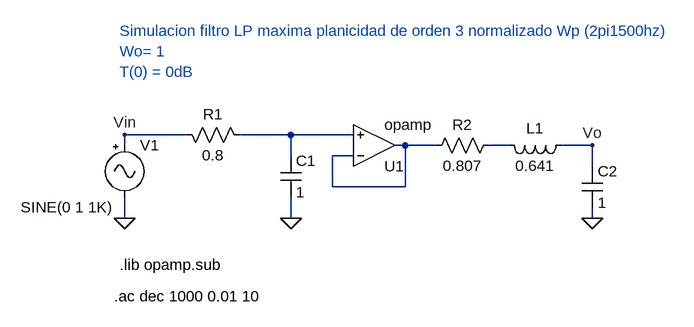
[diagram p0: schematic ts_3_normalizado.asc]
ts_3_normalizado.asc, the LTspice schematic file:
Version 4
SHEET 1 880 680
WIRE -288 32 -384 32
WIRE -128 32 -208 32
WIRE -32 32 -128 32
WIRE -384 48 -384 32
WIRE 48 48 32 48
WIRE 96 48 48 48
WIRE 208 48 176 48
WIRE 336 48 288 48
WIRE -128 64 -128 32
WIRE -32 64 -64 64
WIRE 336 80 336 48
WIRE -64 112 -64 64
WIRE 48 112 48 48
WIRE 48 112 -64 112
WIRE -384 160 -384 128
WIRE -128 160 -128 128
WIRE 336 160 336 144
FLAG -384 160 0
FLAG -384 32 Vin
FLAG 336 48 Vo
FLAG -128 160 0
FLAG 336 160 0
SYMBOL res -192 48 M270
WINDOW 0 32 56 VTop 2
WINDOW 3 0 56 VBottom 2
SYMATTR InstName R1
SYMATTR Value 0.8
SYMBOL Misc/signal -384 32 R0
WINDOW 3 -160 111 Left 2
SYMATTR InstName V1
SYMATTR Value2 AC 1
SYMBOL cap -144 64 R0
SYMATTR InstName C1
SYMATTR Value 1
SYMBOL cap 320 80 R0
SYMATTR InstName C2
SYMATTR Value 1
SYMBOL res 192 32 R90
WINDOW 0 0 56 VBottom 2
WINDOW 3 32 56 VTop 2
SYMATTR InstName R2
SYMATTR Value 0.807
SYMBOL ind 304 32 R90
WINDOW 0 5 56 VBottom 2
WINDOW 3 32 56 VTop 2
SYMATTR InstName L1
SYMATTR Value 0.641
SYMBOL Opamps/opamp 0 112 M180
SYMATTR InstName U1
TEXT -400 280 Left 2 !.ac dec 1000 0.01 10
TEXT -392 232 Left 2 !.lib opamp.sub
TEXT -392 -128 Left 2 ;Simulacion filtro LP maxima planicidad de orden 3 normalizado Wp (2pi1500hz)\nWo= 1\nT(0) = 0dB

The netlist it stands for:
* ts_3_normalizado.asc
R1 N001 Vin 0.8
V1 Vin 0 SINE(0 1 1K) AC 1
C1 N001 0 1
C2 Vo 0 1
R2 N003 N002 0.807
L1 Vo N003 0.641
XU1 N002 N001 N002 opamp Aol=100K GBW=10Meg  ; pins invin noninvin out
.ac dec 1000 0.01 10
.lib opamp.sub
* Simulacion filtro LP maxima planicidad de orden 3 normalizado Wp (2pi1500hz)
* Wo= 1
* T(0) = 0dB
.backanno
.end